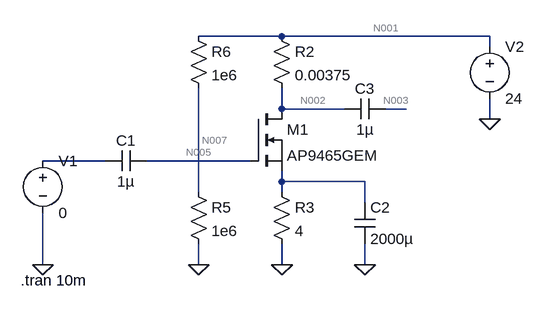
[diagram p0: schematic Draft1.asc]
Draft1.asc, the LTspice schematic file:
Version 4
SHEET 1 880 680
WIRE 160 0 32 0
WIRE 480 0 160 0
WIRE 480 16 480 0
WIRE 160 112 160 80
WIRE 256 112 160 112
WIRE 352 112 320 112
WIRE 480 128 480 96
WIRE -112 192 -208 192
WIRE 112 192 -48 192
WIRE 160 224 160 208
WIRE 288 224 160 224
WIRE 32 240 32 80
WIRE 160 240 160 224
WIRE 288 256 288 224
WIRE -208 352 -208 272
WIRE 32 352 32 320
WIRE 160 352 160 320
WIRE 288 352 288 320
FLAG 480 128 0
FLAG 288 352 0
FLAG 160 352 0
FLAG 32 352 0
FLAG -208 352 0
SYMBOL nmos 112 112 R0
SYMATTR InstName M1
SYMATTR Value AP9465GEM
SYMBOL res 144 -16 R0
SYMATTR InstName R2
SYMATTR Value 0.00375
SYMBOL res 144 224 R0
SYMATTR InstName R3
SYMATTR Value 4
SYMBOL res 16 224 R0
SYMATTR InstName R5
SYMATTR Value 1e6
SYMBOL res 16 -16 R0
SYMATTR InstName R6
SYMATTR Value 1e6
SYMBOL cap -48 176 R90
WINDOW 0 0 32 VBottom 2
WINDOW 3 32 32 VTop 2
SYMATTR InstName C1
SYMATTR Value 1µ
SYMBOL cap 320 96 R90
WINDOW 0 0 32 VBottom 2
WINDOW 3 32 32 VTop 2
SYMATTR InstName C3
SYMATTR Value 1µ
SYMBOL voltage -208 176 R0
WINDOW 123 0 0 Left 0
WINDOW 39 0 0 Left 0
SYMATTR InstName V1
SYMATTR Value 0
SYMBOL voltage 480 0 R0
WINDOW 123 0 0 Left 0
WINDOW 39 0 0 Left 0
SYMATTR InstName V2
SYMATTR Value 24
SYMBOL cap 272 256 R0
SYMATTR InstName C2
SYMATTR Value 2000µ
TEXT -242 376 Left 2 !.tran 10m

The netlist it stands for:
* Draft1.asc
M1 N002 N005 N006 N006 AP9465GEM
R2 N001 N002 0.00375
R3 N006 0 4
R5 N007 0 1e6
R6 N001 N007 1e6
C1 N005 N004 1µ
C3 N003 N002 1µ
V1 N004 0 0
V2 N001 0 24
C2 N006 0 2000µ
.model NMOS NMOS
.model PMOS PMOS
.lib standard.mos
.tran 10m
.backanno
.end

* Results of the author's LTspice run, read from the files saved beside the schematic
* Operating Point, zero values left out:
*   V(n002) = 24 V
*   V(n001) = 24 V
*   V(n007) = 12 V
*   V(n003) = 24 µV
*   Id(M1) = 26.65 pA
*   Is(M1) = -26.65 pA
*   I(R6) = 12 µA
*   I(R5) = 12 µA
*   I(R3) = 51 pA
*   I(R2) = 52.11 pA
*   I(V2) = -12 µA
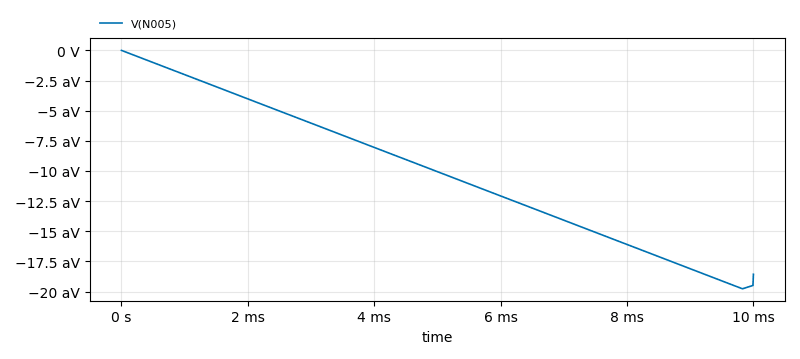
[diagram p1: Transient Analysis of Draft1.asc, plotted from the saved traces]
* Transient Analysis, 1 run:
*   V(N005): min -0.01977 fV, max 0 V, average -0.01005 fV, rms 0.01409 fV, last -0.01856 fV